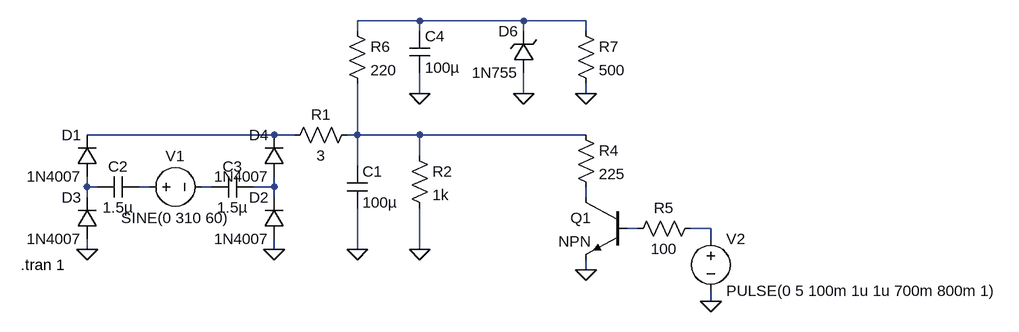
[diagram p0: schematic fonte.asc]
fonte.asc, the LTspice schematic file:
Version 4
SHEET 1 1432 680
WIRE 480 -96 384 -96
WIRE 640 -96 480 -96
WIRE 736 -96 640 -96
WIRE 384 -80 384 -96
WIRE 480 -80 480 -96
WIRE 640 -80 640 -96
WIRE 736 -80 736 -96
WIRE 480 16 480 -16
WIRE 640 16 640 -16
WIRE 736 16 736 0
WIRE 256 80 -32 80
WIRE 288 80 256 80
WIRE 384 80 384 0
WIRE 384 80 368 80
WIRE 480 80 384 80
WIRE 736 80 480 80
WIRE 480 112 480 80
WIRE 384 128 384 80
WIRE -32 160 -32 144
WIRE -16 160 -32 160
WIRE 64 160 48 160
WIRE 160 160 144 160
WIRE 256 160 256 144
WIRE 256 160 224 160
WIRE -32 176 -32 160
WIRE 256 176 256 160
WIRE 736 176 736 160
WIRE 816 224 800 224
WIRE 928 224 896 224
WIRE 928 240 928 224
WIRE -32 256 -32 240
WIRE 256 256 256 240
WIRE 384 256 384 192
WIRE 480 256 480 192
WIRE 736 288 736 272
WIRE 928 336 928 320
FLAG -32 256 0
FLAG 256 256 0
FLAG 384 256 0
FLAG 480 256 0
FLAG 736 288 0
FLAG 928 336 0
FLAG 640 16 0
FLAG 480 16 0
FLAG 736 16 0
SYMBOL voltage 48 160 R270
WINDOW 0 32 56 VTop 2
WINDOW 3 -32 56 VBottom 2
WINDOW 123 0 0 Left 2
WINDOW 39 0 0 Left 2
SYMATTR InstName V1
SYMATTR Value SINE(0 310 60)
SYMBOL diode -16 144 R180
WINDOW 0 24 64 Left 2
WINDOW 3 24 0 Left 2
SYMATTR InstName D1
SYMATTR Value 1N4007
SYMBOL diode -16 240 R180
WINDOW 0 24 64 Left 2
WINDOW 3 24 0 Left 2
SYMATTR InstName D3
SYMATTR Value 1N4007
SYMBOL res 384 64 R90
WINDOW 0 0 56 VBottom 2
WINDOW 3 32 56 VTop 2
SYMATTR InstName R1
SYMATTR Value 3
SYMBOL cap 368 128 R0
SYMATTR InstName C1
SYMATTR Value 100µ
SYMBOL res 464 96 R0
SYMATTR InstName R2
SYMATTR Value 1k
SYMBOL diode 272 240 R180
WINDOW 0 24 64 Left 2
WINDOW 3 24 0 Left 2
SYMATTR InstName D2
SYMATTR Value 1N4007
SYMBOL diode 272 144 R180
WINDOW 0 24 64 Left 2
WINDOW 3 24 0 Left 2
SYMATTR InstName D4
SYMATTR Value 1N4007
SYMBOL cap 48 144 R90
WINDOW 0 0 32 VBottom 2
WINDOW 3 32 32 VTop 2
SYMATTR InstName C2
SYMATTR Value 1.5µ
SYMBOL cap 224 144 R90
WINDOW 0 0 32 VBottom 2
WINDOW 3 32 32 VTop 2
SYMATTR InstName C3
SYMATTR Value 1.5µ
SYMBOL res 720 64 R0
SYMATTR InstName R4
SYMATTR Value 225
SYMBOL npn 800 176 M0
SYMATTR InstName Q1
SYMBOL res 912 208 R90
WINDOW 0 0 56 VBottom 2
WINDOW 3 32 56 VTop 2
SYMATTR InstName R5
SYMATTR Value 100
SYMBOL voltage 928 224 R0
WINDOW 123 0 0 Left 2
WINDOW 39 0 0 Left 2
SYMATTR InstName V2
SYMATTR Value PULSE(0 5 100m 1u 1u 700m 800m 1)
SYMBOL res 368 -96 R0
SYMATTR InstName R6
SYMATTR Value 220
SYMBOL cap 464 -80 R0
SYMATTR InstName C4
SYMATTR Value 100µ
SYMBOL zener 656 -16 R180
WINDOW 0 24 64 Left 2
WINDOW 3 24 0 Left 2
SYMATTR InstName D6
SYMATTR Value 1N755
SYMATTR Description Diode
SYMATTR Type diode
SYMBOL res 720 -96 R0
SYMATTR InstName R7
SYMATTR Value 500
TEXT -134 280 Left 2 !.tran 1

The netlist it stands for:
* fonte.asc
V1 N005 N006 SINE(0 310 60)
D1 N004 N002 1N4007
D3 0 N004 1N4007
R1 N003 N002 3
C1 N003 0 100µ
R2 N003 0 1k
D2 0 N007 1N4007
D4 N007 N002 1N4007
C2 N005 N004 1.5µ
C3 N007 N006 1.5µ
R4 N003 N008 225
Q1 N008 N009 0 0 NPN
R5 N010 N009 100
V2 N010 0 PULSE(0 5 100m 1u 1u 700m 800m 1)
R6 N001 N003 220
C4 N001 0 100µ
D6 0 N001 1N755
R7 N001 0 500
.model D D
.lib standard.dio
.model NPN NPN
.model PNP PNP
.lib standard.bjt
.tran 1
.backanno
.end